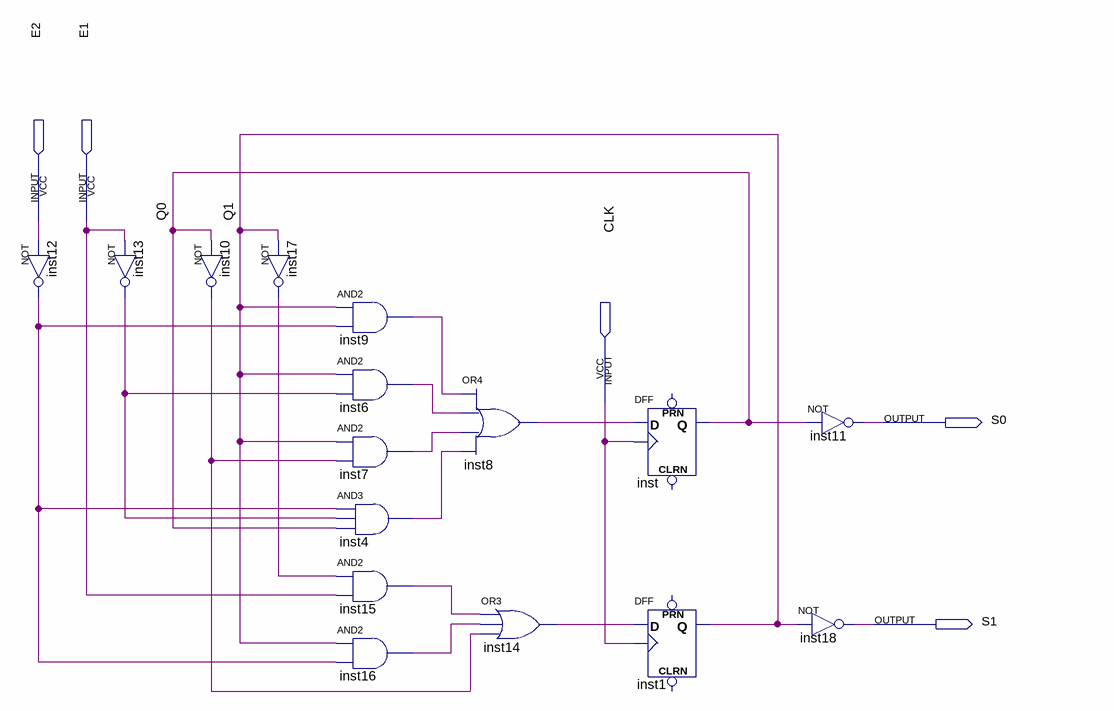
[diagram p0: schematic sheet]
// Quartus schematic practica2_ff.bdf as structural Verilog: 16 symbols, 5 pins
module practica2_ff (
  input  E2,
  input  E1,
  input  CLK,
  output S0,
  output S1
);

  wire inst4_out, inst6_out, inst7_out, inst8_out, inst9_out, inst10_out, inst12_out, inst13_out, inst14_out,
       inst15_out, inst16_out, inst17_out, Q0, Q1;

  not inst12 (inst12_out, E2);
  not inst13 (inst13_out, E1);
  not inst10 (inst10_out, Q0);
  not inst17 (inst17_out, Q1);
  and inst9 (inst9_out, Q1, inst12_out);
  and inst6 (inst6_out, Q1, inst13_out);
  and inst7 (inst7_out, Q1, inst10_out);
  and inst4 (inst4_out, inst12_out, inst13_out, Q0);
  and inst15 (inst15_out, inst17_out, E1);
  and inst16 (inst16_out, Q1, inst12_out);
  or inst8 (inst8_out, inst9_out, inst6_out, inst7_out, inst4_out);
  or inst14 (inst14_out, inst15_out, inst16_out, inst10_out);
  DFF inst (.CLK(CLK), .D(inst8_out), .Q(Q0));  // open: CLRN, PRN
  DFF inst1 (.CLK(CLK), .D(inst14_out), .Q(Q1));  // open: CLRN, PRN
  not inst11 (S0, Q0);
  not inst18 (S1, Q1);
endmodule
